# Altium schematic sheet GregTrack_BIG_POW_v1_0.SchDoc
size A3; CompanyName: HESSO; Address1: Route du Rawyl 47; Address2: 1950 Sion; Address3: Switzerland; PageSetup: Record=PageOptions|CenterHorizontal=True|CenterVertical=True|PrintScale=1.00|XCorrection=1.00|YCorrection=1.00|PrintKind=1|BorderSize=5000000|LeftOffset=0|BottomOffset=0|Orientation=2|PaperLength=1000|PaperWidth=1000|Scale=100|PaperSource=15|PrintQuality=1200|MediaType=1|DitherType=10|PrintScaleMode=1|PaperKind=A4|PaperIndex=9; ProjectName: Project Name
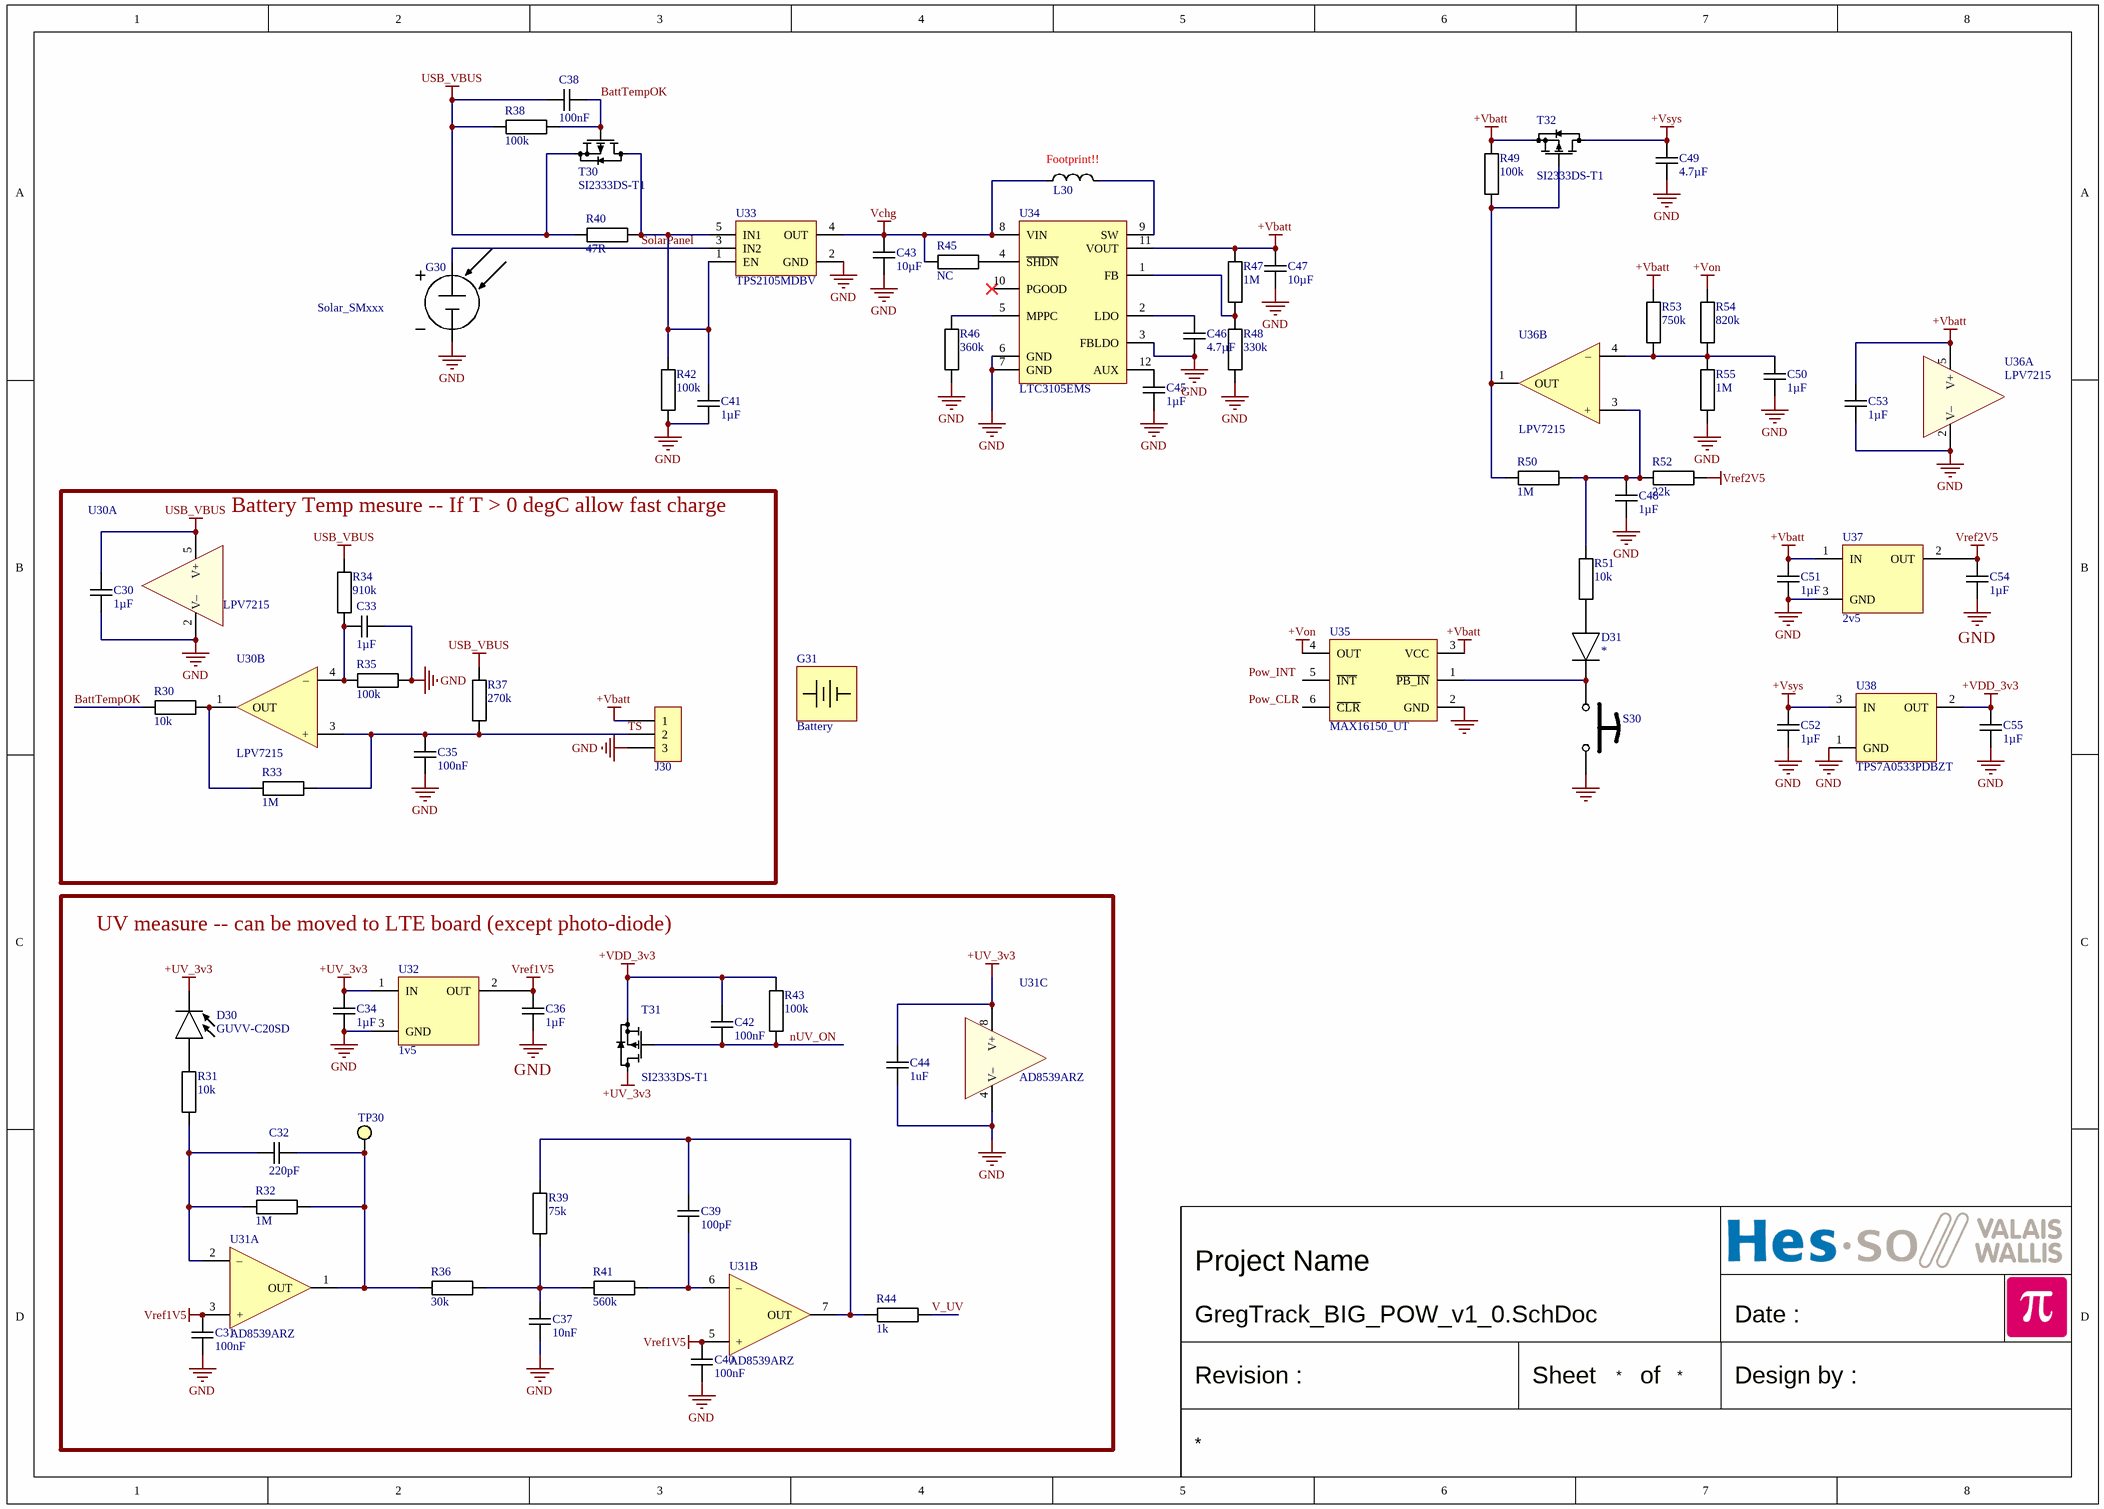
[diagram p0: GregTrack_BIG_POW_v1_0.SchDoc]

## Parts
C30  1µF  [CAPACITOR 1005 REFLOW]
C31  100nF  [CAPACITOR 1005 REFLOW]
C32  220pF  [CAPACITOR 1005 REFLOW]
C33  1µF  [CAPACITOR 1005 REFLOW]
C34  1µF  [CAPACITOR 1005 REFLOW]
C35  100nF  [CAPACITOR 1005 REFLOW]
C36  1µF  [CAPACITOR 1005 REFLOW]
C37  10nF  [CAPACITOR 1005 REFLOW]
C38  100nF  [CAPACITOR 2012 REFLOW]
C39  100pF  [CAPACITOR 1005 REFLOW]
C40  100nF  [CAPACITOR 1005 REFLOW]
C41  1µF  [CAPACITOR 2012 REFLOW]
C42  100nF  [CAPACITOR 1005 REFLOW]
C43  10µF  [CAPACITOR 2012 REFLOW]
C44  1uF  [CAPACITOR 1005 REFLOW]
C45  1µF  [CAPACITOR 1005 REFLOW]
C46  4.7µF  [CAPACITOR 1005 REFLOW]
C47  10µF  [CAPACITOR 2012 REFLOW]
C48  1µF  [CAPACITOR 1005 REFLOW]
C49  4.7µF  [CAPACITOR 1005 REFLOW]
C50  1µF  [CAPACITOR 1005 REFLOW]
C51  1µF  [CAPACITOR 1005 REFLOW]
C52  1µF  [CAPACITOR 1005 REFLOW]
C53  1µF  [CAPACITOR 1005 REFLOW]
C54  1µF  [CAPACITOR 1005 REFLOW]
C55  1µF  [CAPACITOR 1005 REFLOW]
D30  GUVV-C20SD  [Photodiode Genuv GUV series]
D31  *  [DIODE SOD923-F REFLOW]
G30  Solar_SMxxx  [SOLAR_SM531K08TF]
G31  Battery  [Battery_ICP543759PMT]
J30  NC  [PinHeader1x3 P2.54 A SMD]  (value not drawn)  (no BOM)
L30  10uH  [INDUCTOR 5750 REFLOW]  (value not drawn)
R30  10k  [RESISTOR 1005 REFLOW]
R31  10k  [RESISTOR 1005 REFLOW]
R32  1M  [RESISTOR 1005 REFLOW]
R33  1M  [RESISTOR 1005 REFLOW]
R34  910k  [RESISTOR 1005 REFLOW]
R35  100k  [RESISTOR 1005 REFLOW]
R36  30k  [RESISTOR 1005 REFLOW]
R37  270k  [RESISTOR 1005 REFLOW]
R38  100k  [RESISTOR 1005 REFLOW]
R39  75k  [RESISTOR 1005 REFLOW]
R40  47R  [RESISTOR 2012 REFLOW]
R41  560k  [RESISTOR 1005 REFLOW]
R42  100k  [RESISTOR 1005 REFLOW]
R43  100k  [RESISTOR 1005 REFLOW]
R44  1k  [RESISTOR 1005 REFLOW]
R45  NC  [RESISTOR 1005 REFLOW]
R46  360k  [RESISTOR 1005 REFLOW]
R47  1M  [RESISTOR 1005 REFLOW]
R48  330k  [RESISTOR 1005 REFLOW]
R49  100k  [RESISTOR 1005 REFLOW]
R50  1M  [RESISTOR 1005 REFLOW]
R51  10k  [RESISTOR 1005 REFLOW]
R52  22k  [RESISTOR 1005 REFLOW]
R53  750k  [RESISTOR 1005 REFLOW]
R54  820k  [RESISTOR 1005 REFLOW]
R55  1M  [RESISTOR 1005 REFLOW]
S30  *  [Push Button C6.2x4.1 WE 434781025816]  (value not drawn)
T30  SI2333DS-T1  [SOT23 P0.95 C1.6x3.0 H1.3]
T31  SI2333DS-T1  [SOT23 P0.95 C1.6x3.0 H1.3]
T32  SI2333DS-T1  [SOT23 P0.95 C1.6x3.0 H1.3]
TP30  *  [Hole 0.25 D0.8]  (value not drawn)  (no BOM)
U30  LPV7215  [SOT23-5 P0.95 C1.6x3.0 H1.3]  (parts A,B of 2)
U31  AD8539ARZ  [SO8 P1.27 C4.0X5.0 H1.75]  (parts A,B,C of 3)
U32  1v5  [SOT23 P0.95 C1.6x3.0 H1.3]
U33  TPS2105MDBV  [SOT23-5 P0.95 C1.6x3.0 H1.3]
U34  LTC3105EMS  [MSOP12 P0.65 C3.0X4.0 H0.9]
U35  MAX16150_UT  [SOT23-6 P0.95 C1.5x3.0 H1.3]
U36  LPV7215  [SOT23-5 P0.95 C1.6x3.0 H1.3]  (parts A,B of 2)
U37  2v5  [SOT23 P0.95 C1.6x3.0 H1.3]
U38  TPS7A0533PDBZT  [SOT23 P0.95 C1.6x3.0 H1.3]

## Blocks framed on the sheet
Battery Temp mesure -- If T > 0 degC allow fast charge: C30 C33 C35 J30 R30 R33-R35 R37 U30
UV measure -- can be moved to LTE board (except photo-diode): C31 C32 C34 C36 C37 C39 C40 C42 C44 D30 R31 R32 R36 R39 R41 R43 R44 T31 TP30 U31 U32

## Nets
+UV_3v3: C34.2 C44.2 D30.1(C) T31.3(D) U31.8(V+) U32.1(IN)
+Vbatt: C47.2 C51.2 C53.2 J30.1 R47.1 R49.2 R53.2 T32.2(S) U34.11(VOUT) U35.3(VCC) U36.5(V+) U37.1(IN)
+VDD_3v3: C42.1 C55.2 R43.2 T31.2(S) U38.2(OUT)
+Von: R54.2 U35.4(OUT)
+Vsys: C49.2 C52.2 T32.3(D) U38.3(IN)
GND: C30.1 C31.1 C33.1 C34.1 C35.2 C36.1 C37.1 C40.1 C41.1 C43.1 C44.1 C45.1 C46.1 C47.1 C48.1 C49.1 C50.1 C51.1 C52.1 C53.1 C54.1 C55.1 G30.2(-) J30.3 R35.1 R42.2 R46.2 R48.2 R55.1 S30.2 U30.2(V–) U31.4(V–) U32.3(GND) U33.2(GND) U34.3(FBLDO) U34.6(GND) U34.7(GND) U35.2(GND) U36.2(V–) U37.3(GND) U38.1(GND)
USB_VBUS: C30.2 C38.2 R34.1 R37.2 R38.1 R40.1 T30.2(S) U30.5(V+)
Vchg: C43.2 L30.1 R45.1 U33.4(OUT) U34.8(VIN)
Vref1V5: C31.2 C36.2 C40.2 U31.3(+) U31.5(+) U32.2(OUT)
Vref2V5: C54.2 R52.2 U37.2(OUT)
BattTempOK: C38.1 R30.2 R38.2 T30.1(G)
nUV_ON: C42.2 R43.1 T31.1(G)
SolarPanel: G30.1(+) U33.3(IN2)
TS: C35.1 J30.2 R33.1 R37.1 U30.3(+)
V_UV: R44.1
NetC32_1: C32.1 R31.1 R32.2 U31.2(–)
NetC32_2: C32.2 R32.1 R36.2 TP30.1 U31.1(OUT)
NetC33_2: C33.2 R34.2 R35.2 U30.4(–)
NetC37_2: C37.2 R36.1 R39.1 R41.2
NetC39_1: C39.1 R41.1 U31.6(–)
NetC39_2: C39.2 R39.2 R44.2 U31.7(OUT)
NetC41_2: C41.2 R40.2 R42.1 T30.3(D) U33.1(EN) U33.5(IN1)
NetC45_2: C45.2 U34.12(AUX)
NetC46_2: C46.2 U34.2(LDO)
NetC48_2: C48.2 R50.2 R51.1 R52.1 U36.3(+)
NetC50_2: C50.2 R53.1 R54.1 R55.2 U36.4(–)
NetD30_2: D30.2(A) R31.2
NetD31_1: D31.1(C) S30.1 U35.1(~{PB_IN})
NetD31_2: D31.2(A) R51.2
NetL30_2: L30.2 U34.9(SW)
NetR30_1: R30.1 R33.2 U30.1(OUT)
NetR45_2: R45.2 U34.4(~{SHDN})
NetR46_1: R46.1 U34.5(MPPC)
NetR47_2: R47.2 R48.1 U34.1(FB)
NetR49_1: R49.1 R50.1 T32.1(G) U36.1(OUT)

Not connected (* = marked no-connect by the designer): U34 10(PGOOD)*; U35 5(~{INT}) 6(~{CLR})

## Notes on the sheet
- (near L30) Footprint!!
- Labels drawn without touching a wire or pin: Pow_CLR, Pow_INT
- Date :
- Revision :
- Sheet
- of
- Design by :

## Library data of the parts
C30 C31 C33-C36 C40 C42 C44-C46 C48-C55 = Capacitor: Capacitor 1005; TempCoef: X5R; Tolerance: +/-20%; Voltage: 10V
  C30 C33 C34 C36 C45 C48 C50-C55: Value: 1µF; STOCK: NO
  C31 C40: Value: 100nF
  C35 C42: Value: 100nF; STOCK: NO
  C44: Value: 1uF
  C46 C49: Value: 4.7µF; STOCK: NO
C32 C37 C39 = Capacitor: Capacitor 1005; TempCoef: X5R; Tolerance: +/-5%; Voltage: 10V
  C32: Value: 220pF
  C37: Value: 10nF
  C39: Value: 100pF
C38 C41 C43 C47 = Capacitor: Capacitor 2012; TempCoef: X5R; Tolerance: +/-20%; Voltage: 10V; STOCK: NO
  C38: Value: 100nF
  C41: Value: 1µF
  C43 C47: Value: 10µF
D30 = Photodiode Genuv GUVV-C20SD: Schottky Photodiode SMD 2.4x1.8mm; Value: GUVV-C20SD
D31 = DIODE: Diode generic 2 leads; Value: *
G31 = Battery: ICP622540PMT
J30 = PinHeader1x3: Plug connector; Value: NC; STOCK: NO
L30 = Inductor: Inductor IHLP2020BZER100M51; Value: 10uH
R30-R39 R41-R50 R52-R55 = Resistor: Resistor 1005; Tolerance: 1%
  R30: Value: 10k; STOCK: NO
  R31: Value: 10k
  R32: Value: 1M
  R33 R47 R50 R55: Value: 1M; STOCK: NO
  R34: Value: 910k; STOCK: NO
  R35 R38 R42 R43 R49: Value: 100k; STOCK: NO
  R36: Value: 30k
  R37: Value: 270k; STOCK: NO
  R39: Value: 75k
  R41: Value: 560k
  R44: Value: 1k
  R45: Value: NC; STOCK: NO
  R46: Value: 360k; STOCK: NO
  R48: Value: 330k; STOCK: NO
  R52: Value: 22k; STOCK: NO
  R53: Value: 750k; STOCK: NO
  R54: Value: 820k; STOCK: NO
R40 = Resistor: Resistor 2012, 1% 0.25W; Value: 47R; STOCK: NO; Tolerance: 1%
R51 = Resistor: Resistor 1005; Tolerance: 1%; ECassembly: YES; Value: 10k
S30 = Push Button 2Pins: Push Button, 2 pins; Value: *
T30-T32 = MOS-P SOT23 G-S-D: Generic MOS-P; Value: SI2333DS-T1; STOCK: NO
TP30 = Hole: Value: *
U30 U36 = COMPARATOR SINGLE SOT23-5: Generic Single Comparator 5pins 1OUT/2-V/3+IN/4-IN/5+V; Value: LPV7215; STOCK: NO
U31 = OPA DUAL: Generic dual OPA 8 pins; Value: AD8539ARZ
U32 U37 = REFERENCE SOT23 IN,OUT,GND: ISL21080; STOCK: NO
  U32: Value: 1v5
  U37: Value: 2v5
U33 = TPS2105MDBV: Power-Distribution Switch; Value: TPS2105MDBV
U34 = LTC3105EMS: 400mA Step-Up DC/DC Converter; Value: LTC3105EMS
U35 = MAX16150_UT: nanoPower Pushbutton On/Off Controller and Battery Freshness Seal; Value: MAX16150_UT
U38 = REGPOS SOT23 GND,OUT,IN: Generic Positive Voltage Regulator; Value: TPS7A0533PDBZT; STOCK: ORDERED